# Altium schematic sheet S02_Power_Converters.SchDoc: Power Converters
size 381 x 241 mm; SheetNumber: 2; SheetTotal: 12
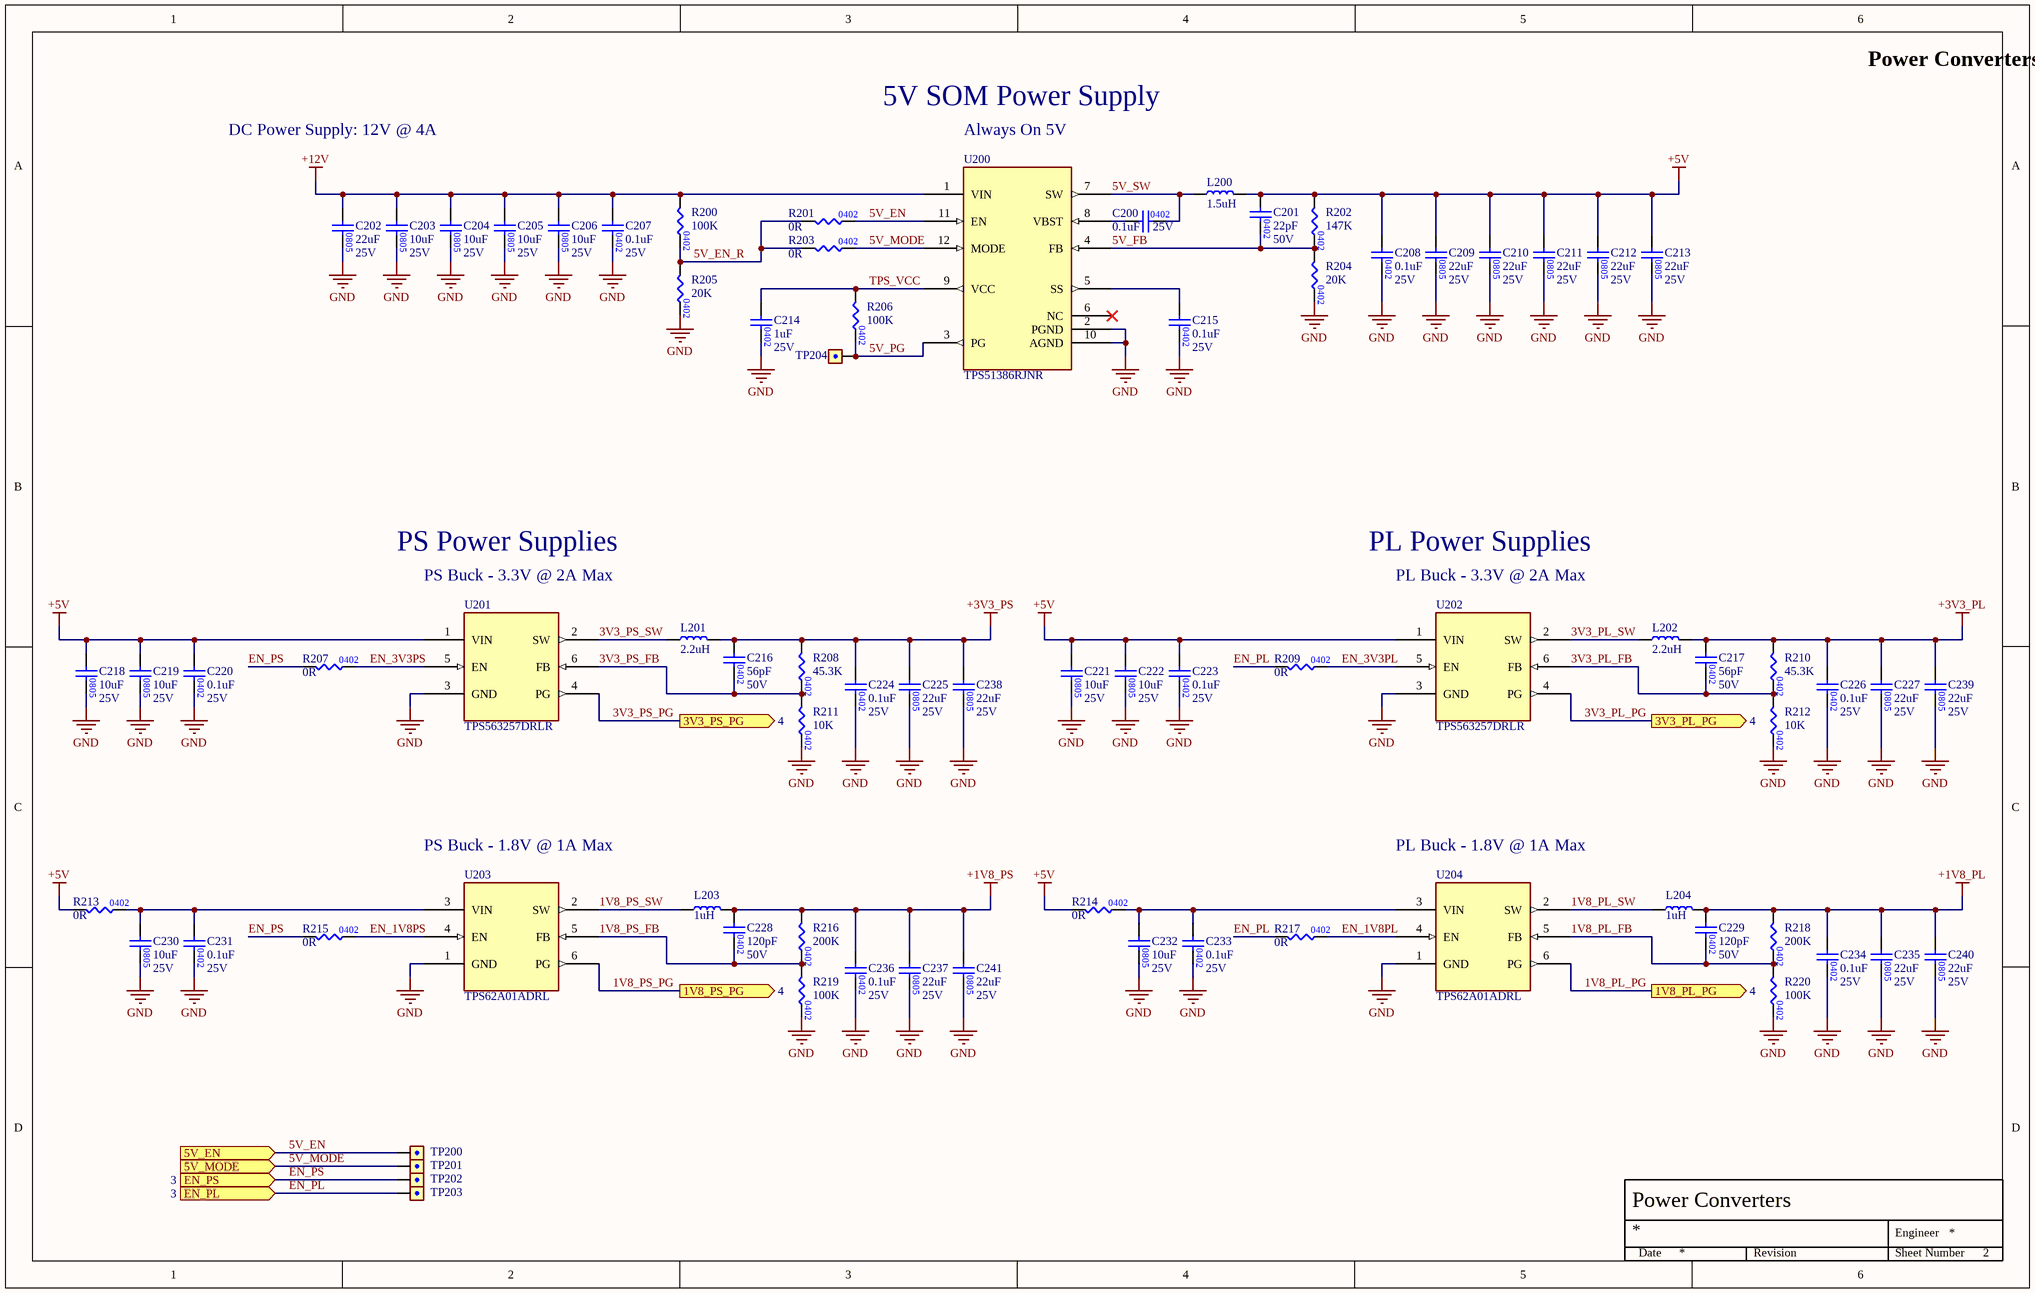
[diagram p0: S02_Power_Converters.SchDoc]

## Parts
C200  value 0.1uF  Voltage Rating: 25V  [CAP0402]  (hidden comment: CAP_0402)
C201  value 22pF  Voltage Rating: 50V  [CAP0402]  (hidden comment: CAP_0402)
C202  value 22uF  Voltage Rating: 25V  [CAP0805]  (hidden comment: CAP_0805)
C203  value 10uF  Voltage Rating: 25V  [CAP0805]  (hidden comment: CAP_0805)
C204  value 10uF  Voltage Rating: 25V  [CAP0805]  (hidden comment: CAP_0805)
C205  value 10uF  Voltage Rating: 25V  [CAP0805]  (hidden comment: CAP_0805)
C206  value 10uF  Voltage Rating: 25V  [CAP0805]  (hidden comment: CAP_0805)
C207  value 0.1uF  Voltage Rating: 25V  [CAP0402]  (hidden comment: CAP_0402)
C208  value 0.1uF  Voltage Rating: 25V  [CAP0402]  (hidden comment: CAP_0402)
C209  value 22uF  Voltage Rating: 25V  [CAP0805]  (hidden comment: CAP_0805)
C210  value 22uF  Voltage Rating: 25V  [CAP0805]  (hidden comment: CAP_0805)
C211  value 22uF  Voltage Rating: 25V  [CAP0805]  (hidden comment: CAP_0805)
C212  value 22uF  Voltage Rating: 25V  [CAP0805]  (hidden comment: CAP_0805)
C213  value 22uF  Voltage Rating: 25V  [CAP0805]  (hidden comment: CAP_0805)
C214  value 1uF  Voltage Rating: 25V  [CAP0402]  (hidden comment: CAP_0402)
C215  value 0.1uF  Voltage Rating: 25V  [CAP0402]  (hidden comment: CAP_0402)
C216  value 56pF  Voltage Rating: 50V  [CAP0402]  (hidden comment: CAP_0402)
C217  value 56pF  Voltage Rating: 50V  [CAP0402]  (hidden comment: CAP_0402)
C218  value 10uF  Voltage Rating: 25V  [CAP0805]  (hidden comment: CAP_0805)
C219  value 10uF  Voltage Rating: 25V  [CAP0805]  (hidden comment: CAP_0805)
C220  value 0.1uF  Voltage Rating: 25V  [CAP0402]  (hidden comment: CAP_0402)
C221  value 10uF  Voltage Rating: 25V  [CAP0805]  (hidden comment: CAP_0805)
C222  value 10uF  Voltage Rating: 25V  [CAP0805]  (hidden comment: CAP_0805)
C223  value 0.1uF  Voltage Rating: 25V  [CAP0402]  (hidden comment: CAP_0402)
C224  value 0.1uF  Voltage Rating: 25V  [CAP0402]  (hidden comment: CAP_0402)
C225  value 22uF  Voltage Rating: 25V  [CAP0805]  (hidden comment: CAP_0805)
C226  value 0.1uF  Voltage Rating: 25V  [CAP0402]  (hidden comment: CAP_0402)
C227  value 22uF  Voltage Rating: 25V  [CAP0805]  (hidden comment: CAP_0805)
C228  value 120pF  Voltage Rating: 50V  [CAP0402]  (hidden comment: CAP_0402)
C229  value 120pF  Voltage Rating: 50V  [CAP0402]  (hidden comment: CAP_0402)
C230  value 10uF  Voltage Rating: 25V  [CAP0805]  (hidden comment: CAP_0805)
C231  value 0.1uF  Voltage Rating: 25V  [CAP0402]  (hidden comment: CAP_0402)
C232  value 10uF  Voltage Rating: 25V  [CAP0805]  (hidden comment: CAP_0805)
C233  value 0.1uF  Voltage Rating: 25V  [CAP0402]  (hidden comment: CAP_0402)
C234  value 0.1uF  Voltage Rating: 25V  [CAP0402]  (hidden comment: CAP_0402)
C235  value 22uF  Voltage Rating: 25V  [CAP0805]  (hidden comment: CAP_0805)
C236  value 0.1uF  Voltage Rating: 25V  [CAP0402]  (hidden comment: CAP_0402)
C237  value 22uF  Voltage Rating: 25V  [CAP0805]  (hidden comment: CAP_0805)
C238  value 22uF  Voltage Rating: 25V  [CAP0805]  (hidden comment: CAP_0805)
C239  value 22uF  Voltage Rating: 25V  [CAP0805]  (hidden comment: CAP_0805)
C240  value 22uF  Voltage Rating: 25V  [CAP0805]  (hidden comment: CAP_0805)
C241  value 22uF  Voltage Rating: 25V  [CAP0805]  (hidden comment: CAP_0805)
L200  Inductance: 1.5uH  [IHLP5050CEER1R5M01]  (hidden comment: IHLP5050CEER1R5M01)
L201  Inductance: 2.2uH  [SDCHA1V6045-2R2-R]  (hidden comment: SDCHA1V6045-2R2-R)
L202  Inductance: 2.2uH  [SDCHA1V6045-2R2-R]  (hidden comment: SDCHA1V6045-2R2-R)
L203  Inductance: 1uH  [IND_2520]  (hidden comment: DFE252012F-1R0M)
L204  Inductance: 1uH  [IND_2520]  (hidden comment: DFE252012F-1R0M)
R200  Resistance: 100K  [RES0402]  (hidden comment: RES_0402)
R201  Resistance: 0R  [RES0402]  (hidden comment: RES_0402)
R202  Resistance: 147K  [RES0402]  (hidden comment: RES_0402)
R203  Resistance: 0R  [RES0402]  (hidden comment: RES_0402)
R204  Resistance: 20K  [RES0402]  (hidden comment: RES_0402)
R205  Resistance: 20K  [RES0402]  (hidden comment: RES_0402)
R206  Resistance: 100K  [RES0402]  (hidden comment: RES_0402)
R207  Resistance: 0R  [RES0402]  (hidden comment: RES_0402)
R208  Resistance: 45.3K  [RES0402]  (hidden comment: RES_0402)
R209  Resistance: 0R  [RES0402]  (hidden comment: RES_0402)
R210  Resistance: 45.3K  [RES0402]  (hidden comment: RES_0402)
R211  Resistance: 10K  [RES0402]  (hidden comment: RES_0402)
R212  Resistance: 10K  [RES0402]  (hidden comment: RES_0402)
R213  Resistance: 0R  [RES0402]  (hidden comment: RES_0402)
R214  Resistance: 0R  [RES0402]  (hidden comment: RES_0402)
R215  Resistance: 0R  [RES0402]  (hidden comment: RES_0402)
R216  Resistance: 200K  [RES0402]  (hidden comment: RES_0402)
R217  Resistance: 0R  [RES0402]  (hidden comment: RES_0402)
R218  Resistance: 200K  [RES0402]  (hidden comment: RES_0402)
R219  Resistance: 100K  [RES0402]  (hidden comment: RES_0402)
R220  Resistance: 100K  [RES0402]  (hidden comment: RES_0402)
TP200  1mm Round Pad Testpoint  [TP_1MM]  (value not drawn)
TP201  1mm Round Pad Testpoint  [TP_1MM]  (value not drawn)
TP202  1mm Round Pad Testpoint  [TP_1MM]  (value not drawn)
TP203  1mm Round Pad Testpoint  [TP_1MM]  (value not drawn)
TP204  1mm Round Pad Testpoint  [TP_1MM]  (value not drawn)
U200  TPS51386RJNR  [TI_RJN0012A_POWERVQFN12]
U201  TPS563257DRLR  [TI_SOT6_DRL0006A]
U202  TPS563257DRLR  [TI_SOT6_DRL0006A]
U203  TPS62A01ADRL  [TI_SOT6_DRL0006A]
U204  TPS62A01ADRL  [TI_SOT6_DRL0006A]

## Ports
1V8_PL_PG (out, see 4), 1V8_PS_PG (out, see 4), 3V3_PL_PG (out, see 4), 3V3_PS_PG (out, see 4), 5V_EN (in), 5V_MODE (in), EN_PL (in, see 3), EN_PS (in, see 3)

## Nets
+1V8_PL: C229.1 C234.1 C235.1 C240.1 L204.2 R218.1
+1V8_PS: C228.1 C236.1 C237.1 C241.1 L203.2 R216.1
+3V3_PL: C217.1 C226.1 C227.1 C239.1 L202.2 R210.1
+3V3_PS: C216.1 C224.1 C225.1 C238.1 L201.2 R208.1
+5V: C201.1 C208.1 C209.1 C210.1 C211.1 C212.1 C213.1 C218.1 C219.1 C220.1 C221.1 C222.1 C223.1 L200.2 R202.1 R213.1 R214.1 U201.1(VIN) U202.1(VIN)
+12V: C202.1 C203.1 C204.1 C205.1 C206.1 C207.1 R200.1 U200.1(VIN)
GND: C202.2 C203.2 C204.2 C205.2 C206.2 C207.2 C208.2 C209.2 C210.2 C211.2 C212.2 C213.2 C214.2 C215.2 C218.2 C219.2 C220.2 C221.2 C222.2 C223.2 C224.2 C225.2 C226.2 C227.2 C230.2 C231.2 C232.2 C233.2 C234.2 C235.2 C236.2 C237.2 C238.2 C239.2 C240.2 C241.2 R204.2 R205.2 R211.2 R212.2 R219.2 R220.2 U200.2(PGND) U200.10(AGND) U201.3(GND) U202.3(GND) U203.1(GND) U204.1(GND)
1V8_PL_FB: C229.2 R218.2 R220.1 U204.5(FB)
1V8_PL_PG: U204.6(PG) ; port 1V8_PL_PG
1V8_PL_SW: L204.1 U204.2(SW)
1V8_PS_FB: C228.2 R216.2 R219.1 U203.5(FB)
1V8_PS_PG: U203.6(PG) ; port 1V8_PS_PG
1V8_PS_SW: L203.1 U203.2(SW)
3V3_PL_FB: C217.2 R210.2 R212.1 U202.6(FB)
3V3_PL_PG: U202.4(PG) ; port 3V3_PL_PG
3V3_PL_SW: L202.1 U202.2(SW)
3V3_PS_FB: C216.2 R208.2 R211.1 U201.6(FB)
3V3_PS_PG: U201.4(PG) ; port 3V3_PS_PG
3V3_PS_SW: L201.1 U201.2(SW)
5V_EN: R201.2 TP200.1 U200.11(EN) ; port 5V_EN
5V_EN_R: R200.2 R201.1 R203.1 R205.1
5V_FB: C201.2 R202.2 R204.1 U200.4(FB)
5V_MODE: R203.2 TP201.1 U200.12(MODE) ; port 5V_MODE
5V_PG: R206.2 TP204.1 U200.3(PG)
5V_SW: C200.2 L200.1 U200.7(SW)
EN_1V8PL: R217.2 U204.4(EN)
EN_1V8PS: R215.2 U203.4(EN)
EN_3V3PL: R209.2 U202.5(EN)
EN_3V3PS: R207.2 U201.5(EN)
EN_PL: R209.1 R217.1 TP203.1 ; port EN_PL
EN_PS: R207.1 R215.1 TP202.1 ; port EN_PS
TPS_VCC: C214.1 R206.1 U200.9(VCC)
NetC200_1: C200.1 U200.8(VBST)
NetC215_1: C215.1 U200.5(SS)
NetC230_1: C230.1 C231.1 R213.2 U203.3(VIN)
NetC232_1: C232.1 C233.1 R214.2 U204.3(VIN)

Not connected (* = marked no-connect by the designer): U200 6(NC)*

## Notes on the sheet
- DC Power Supply: 12V @ 4A
- 5V SOM Power Supply
- Always On 5V
- PS Power Supplies
- PL Power Supplies
- PS Buck - 3.3V @ 2A Max
- PL Buck - 3.3V @ 2A Max
- PS Buck - 1.8V @ 1A Max
- PL Buck - 1.8V @ 1A Max
- Engineer
- Date
- Revision
- Sheet Number

## Library data of the parts
C200 C207 C208 C215 C220 C223 C224 C226 C231 C233 C234 C236 = CAP_CL05A104KA5NNNC: CAP CER 0.1UF 25V X5R 0402; Manufacturer: Samsung Electro-Mechanics; Tolerance: 10%; Manufacturer Part Number 1: CL05A104KA5NNNC; Case/Package: 0402; Mounting Type: Surface Mount; Temperature Coefficient: X5R
C201 = CAP_CL05C220JB51PNC: CAP CER 22PF 50V C0G/NP0 0402; Manufacturer: Samsung Electro-Mechanics; Temperature Coefficient: C0G; Tolerance: 5%; Manufacturer Part Number 1: CL05C220JB51PNC; Case/Package: 0402; Mounting Type: Surface Mount
C202 C209-C213 C225 C227 C235 C237-C241 = CAP_CL21A226MAYNNNE: CAP CER 22UF 25V X5R 0805; Manufacturer: Samsung Electro-Mechanics; Tolerance: 20%; Manufacturer Part Number 1: CL21A226MAYNNNE; Case/Package: 0805; Mounting Type: Surface Mount; Temperature Coefficient: X5R
C203-C206 C218 C219 C221 C222 C230 C232 = CAP_CL21A106KAYNNNE: CAP CER 10UF 25V X5R 0805; Manufacturer: Samsung Electro-Mechanics; Tolerance: 10%; Manufacturer Part Number 1: CL21A106KAYNNNE; Case/Package: 0805; Mounting Type: Surface Mount; Temperature Coefficient: X5R
C214 = CAP_CL10A105KA8NNNC: CAP CER 1UF 25V X5R 0603; Manufacturer: Samsung Electro-Mechanics; Tolerance: 10%; Manufacturer Part Number 1: CL10A105KA8NNNC; Case/Package: 0402; Mounting Type: Surface Mount; Temperature Coefficient: X5R
C216 C217 = CAP_CC0402JRNPO9BN560: CAP CER 56PF 50V C0G/NPO 0402; Manufacturer: YAGEO; Temperature Coefficient: C0G; Tolerance: 5%; Manufacturer Part Number 1: CC0402JRNPO9BN560; Case/Package: 0402; Mounting Type: Surface Mount
C228 C229 = CAP_CL05C121JB51PNC: CAP CER 120PF 50V C0G/NP0 0402; Manufacturer: Samsung Electro-Mechanics; Temperature Coefficient: C0G; Tolerance: 5%; Manufacturer Part Number 1: CL05C121JB51PNC; Case/Package: 0402; Mounting Type: Surface Mount
L200 = IND_IHLP5050CEER1R5M01: FIXED IND 1.5UH 19A 5.5 MOHM SMD; Manufacturer: Vishay Dale; Saturation Current: 35A; Tolerance: 20%; Case/Package: Nonstandard; Manufacturer Part Number: IHLP5050CEER1R5M01; Current Rating: 19A; DC Resistance (DCR): 5.5mOhm
L201 L202 = IND_SDCHA1V6045-2R2-R: IND SMD POWER 2.2UH 6.0A; Manufacturer: Eaton - Electronics Division; Saturation Current: 9.5A; Current Rating: 6A; DC Resistance (DCR): 15mOhm; Tolerance: 20%; Case/Package: Nonstandard; Manufacturer Part Number: SDCHA1V6045-2R2-R
L203 L204 = IND_DFE252012F-1R0M: FIXED IND 1UH 3.3A 0.04OHM SMD; Manufacturer: Murata Electronics; Saturation Current: 4.7A; DC Resistance (DCR): 40mOhm; Tolerance: 20%; Case/Package: 2520; Manufacturer Part Number: DFE252012F-1R0M; Current Rating: 3.3A
R200 R206 R219 R220 = .RES_RC0402FR-07100KL: RES 100K OHM 1% 1/16W 0402; Manufacturer: YAGEO; Manufacturer Part Number: RC0402FR-07100KL; Case/Package: 0402; Tolerance: 1%
R201 R203 R207 R209 R213-R215 R217 = .RES_RC0402JR-070RL: RES 0 OHM JUMPER 1/16W 0402; Manufacturer: YAGEO; Tolerance: 1%; Manufacturer Part Number: RC0402JR-070RL; Case/Package: 0402
R202 = .RES_RC0402FR-07147KL: RES 147K OHM 1% 1/16W 0402; Manufacturer: YAGEO; Manufacturer Part Number: RC0402FR-07147KL; Case/Package: 0402; Tolerance: 1%
R204 R205 = .RES_RC0402FR-0720KL: RES 20K OHM 1% 1/16W 0402; Manufacturer: YAGEO; Manufacturer Part Number: RC0402FR-0720KL; Case/Package: 0402; Tolerance: 1%
R208 R210 = .RES_RC0402FR-0745K3L: RES 45.3K OHM 1% 1/16W 0402; Manufacturer: YAGEO; Manufacturer Part Number: RC0402FR-0745K3L; Case/Package: 0402; Tolerance: 1%
R211 R212 = .RES_RC0402FR-0710KL: RES 10K OHM 1% 1/16W 0402; Manufacturer: YAGEO; Manufacturer Part Number: RC0402FR-0710KL; Case/Package: 0402; Tolerance: 1%
R216 R218 = .RES_RC0402FR-07200KL: RES 200K OHM 1% 1/16W 0402; Manufacturer: YAGEO; Manufacturer Part Number: RC0402FR-07200KL; Case/Package: 0402; Tolerance: 1%
TP200-TP204 = TP_1MM
U200 = TPS51386RJNR: IC REG BUCK ADJ 8A 12-PowerVFQFN; Manufacturer: Texas Instruments; Manufacturer Part Number: TPS51386RJNR
U201 U202 = TPS563257DRLR: IC REG BUCK ADJ 3A SOT563
U203 U204 = TPS62A01ADRL: IC REG BUCK ADJ 1A SOT5X3; Manufacturer: Texas Instruments; Manufacturer Part Number: TLV62568ADRLR